# EAGLE schematic Schematic (EAGLE 9.1.3)
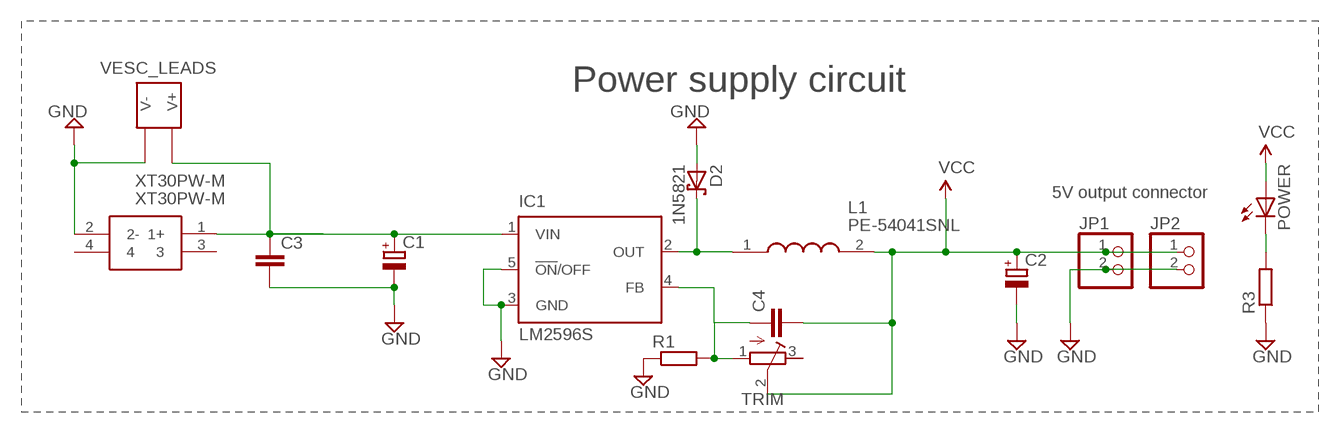
[diagram p0: schematic, sheet 1]

## Parts
C1  CPOL-EUE5-13  [E5-13]
C2  CPOL-EUE2.5-7  [E2,5-7]
C3  C-EUC1206  [C1206]
C4  C2,5-3  [C2.5-3]
D2  1N5821  1N5819-T  [DO41-7.6]
IC1  LM2596S  [TO263-5]
JP1  PINHD-1X2  [1X02]
JP2  PINHD-1X2  [1X02]
L1  PE-54041SNL  [P0846SNLT]
POWER  LEDSML0805  [SML0805]
R1  R-EU_0204/7  [0204/7]
R3  R-EU_R1206  [R1206]
TRIM  R-TRIMM3296W  [RTRIM3296W]
U$1  VESC_LEADS  [VESC_LEADS]
XT30PW-M  XT30PW-M  [XT30PWM]

## Nets
GND: C1.- C2.- C3.2 D2.A IC1.3(GND) IC1.5(!ON!/OFF) JP1.2 JP2.2 R1.1 R3.1 U$1.P$2(V-) XT30PW-M.2(2-)
IN: C1.+ C3.1 IC1.1(VIN) U$1.P$1(V+) XT30PW-M.1(1+)
N$1: POWER.C R3.2
N$2: D2.C IC1.2(OUT) L1.1
N$3: C4.1 IC1.4(FB) R1.2 TRIM.1(A)
VCC: C2.+ C4.2 JP1.1 JP2.1 L1.2 POWER.A TRIM.2(S)
Unconnected: TRIM.3(E) XT30PW-M.3 XT30PW-M.4

## Notes on the sheet
- Power supply circuit
- 5V output connector

## Library data of the parts
C1 C2 = rcl:CPOL-EU: POLARIZED CAPACITOR, European symbol; SPICEPREFIX: C
C3 = rcl:C-EU: CAPACITOR, European symbol
C4 = capacitor-wima:C: CAPACITOR naming: grid - package width
D2 = _mod_diode:1N581*: 1.0A SCHOTTKY BARRIER RECTIFIER Source: http://www.diodes.com/datasheets/ds23001.pdf
IC1 = national-semiconductor:LM2596: SIMPLE SWITCHER® Power Converter 150 kHz 3A Step-Down Voltage Regulator Source: http://www.national.com/ds/LM/LM2596.pdf; MF: NATIONAL SEMICONDUCTOR; MPN: LM2596S-ADJ/NOPB; OC_FARNELL: 9494367; OC_NEWARK: 41K3842
JP1 JP2 = pinhead:PINHD-1X2: PIN HEADER
L1 = PE-54041SNL:PE-54041SNL: Fixed Inductors SIMPLE SWITCHER IND Source: Datasheet <http://productfinder.pulseeng.com/products/datasheets/SPM2007_47.pdf>; DESCRIPTION: Fixed Inductors SIMPLE SWITCHER IND; HEIGHT: 9mm; MANUFACTURER_NAME: Pulse; MANUFACTURER_PART_NUMBER: PE-54041SNL; MOUSER_PART_NUMBER: 673-PE-54041SNL; MOUSER_PRICE-STOCK: https://www.mouser.com/Search/Refine.aspx?Keyword=673-PE-54041SNL
POWER = led:LED: LED OSRAM: - CHIPLED LG R971, LG N971, LY N971, LG Q971, LY Q971, LO R971, LY R971 LH N974, LH R974 LS Q976, LO Q976, LY Q976 LO Q996 - Hyper CHIPLED LW Q18S LB Q993, LB Q99A, LB R99A - SideLED LS A670, LO A670, LY A670, LG A670, LP A670 LB A673, LV A673, LT A673, LW A673 LH A674 LY A675 LS A676, LA A676, LO A676, LY A676, LW A676 LS A679, LY A679, LG A679 - Hyper Micro SIDELED® LS Y876, LA Y876, LO Y876, LY Y876 LT Y87S - SmartLED LW L88C, LW L88S LB L89C, LB L89S, LG L890 LS L89K, LO L89K, LY L89K LS L896, LA L896, LO L896, LY L896 - TOPLED LS T670, LO T670, LY T670, LG T670, LP T670 LSG T670, LSP T670, LSY T670, LOP T670, LYG T670 LG T671, LOG T671, LSG T671 LB T673, LV T673, LT T673, LW T673 LH T674 LS T676, LA T676, LO T676, LY T676, LB T676, LH T676, LSB T676, LW T676 LB T67C, LV T67C, LT T67C, LS T67K, LO T67K, LY T67K, LW E67C LS E67B, LA E67B, LO E67B, LY E67B, LB E67C, LV E67C, LT E67C LW T67C LS T679, LY T679, LG T679 LS T770, LO T770, LY T770, LG T770, LP T770 LB T773, LV T773, LT T773, LW T773 LH T774 LS E675, LA E675, LY E675, LS T675 LS T776, LA T776, LO T776, LY T776, LB T776 LHGB T686 LT T68C, LB T68C - Hyper Mini TOPLED® LB M676 - Mini TOPLED Santana® LG M470 LS M47K, LO M47K, LY M47K Source: http://www.osram.convergy.de LUXEON: - LUMILED® LXK2-PW12-R00, LXK2-PW12-S00, LXK2-PW14-U00, LXK2-PW14-V00 LXK2-PM12-R00, LXK2-PM12-S00, LXK2-PM14-U00 LXK2-PE12-Q00, LXK2-PE12-R00, LXK2-PE12-S00, LXK2-PE14-T00, LXK2-PE14-U00 LXK2-PB12-K00, LXK2-PB12-L00, LXK2-PB12-M00, LXK2-PB14-N00, LXK2-PB14-P00, LXK2-PB14-Q00 LXK2-PR12-L00, LXK2-PR12-M00, LXK2-PR14-Q00, LXK2-PR14-R00 LXK2-PD12-Q00, LXK2-PD12-R00, LXK2-PD12-S00 LXK2-PH12-R00, LXK2-PH12-S00 LXK2-PL12-P00, LXK2-PL12-Q00, LXK2-PL12-R00 Source: www.luxeon.com KINGBRIGHT: KA-3528ASYC Source: www.kingbright.com
R1 = rcl:R-EU_: RESISTOR, European symbol
R3 = resistor:R-EU_: RESISTOR, European symbol
TRIM = resistor:R-TRIMM: Trimm resistor
U$1 = VESC_LEADS:VESC_LEADS
XT30PW-M = XT30PW-M:XT30PW-M: 30A Low Temperature Rise Fire Retardant Plug Source: Datasheet <https://www.tme.eu/sl/Document/ce4077e36b79046da520ca73227e15de/XT30PW SPEC.pdf>; DESCRIPTION: 30A Low Temperature Rise Fire Retardant Plug; HEIGHT: 5mm; MANUFACTURER_NAME: Amass; MANUFACTURER_PART_NUMBER: XT30PW-M